# Altium schematic sheet Linear_Voltage_Regulator[Adjustable].SchDoc
size A; SheetNumber: 3; SheetTotal: 3
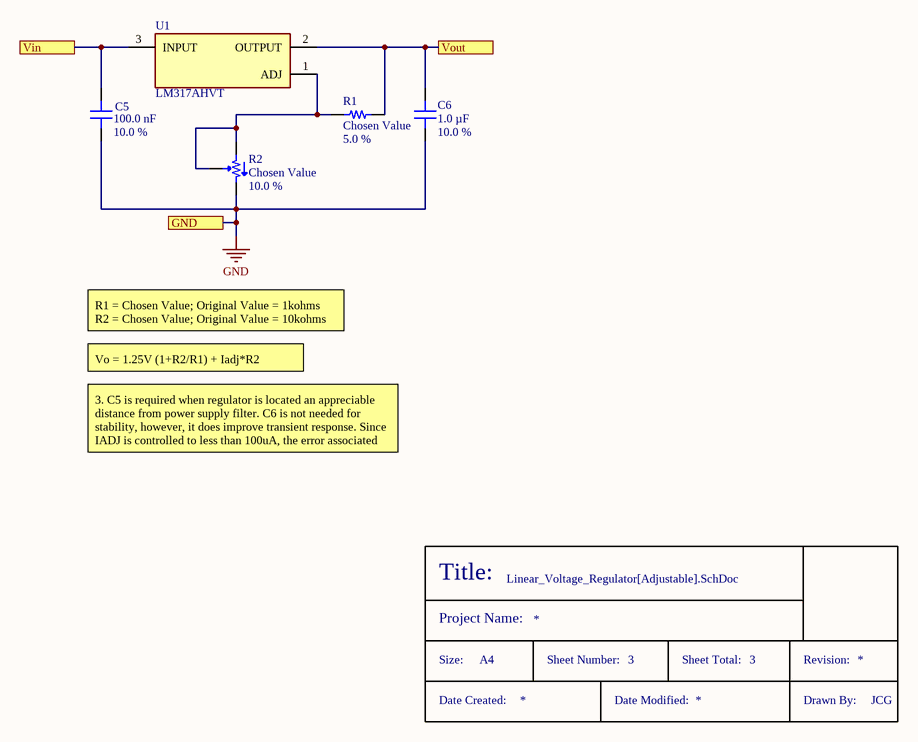
[diagram p0: Linear_Voltage_Regulator[Adjustable].SchDoc]

## Parts
*  Title_Block  (value not drawn)
C5  100.0 nF  Tolerance: 10.0 %  [PCB - CAPACITOR - MLCC - CAP 0_2 RADIAL DISC]
C6  1.0 µF  Tolerance: 10.0 %  [PCB - CAPACITOR - MLCC - CAP 0_2 RADIAL DISC]
R1  Chosen Value  Tolerance: 5.0 %  [PCB - RESISTOR - AXIAL]
R2  Chosen Value  Tolerance: 10.0 %  [PCB - RESISTOR - POTENTIOMETER TRIM POT BOURNS 3386]
U1  LM317AHVT  [FP-340AT-MFG]

## Ports
GND, Vin, Vout

## Nets
GND: C5.2 C6.2 R2.3 ; port GND
Vin: C5.1 U1.3(INPUT) ; port Vin
Vout: C6.1 R1.2 U1.2(OUTPUT) ; port Vout
NetR1_1: R1.1 R2.1 R2.2 U1.1(ADJ)

## Notes on the sheet
- Vo = 1.25V (1+R2/R1) + Iadj*R2
- R1 = Chosen Value; Original Value = 1kohms
  R2 = Chosen Value; Original Value = 10kohms
- 3. C5 is required when regulator is located an appreciable distance from power supply filter. C6 is not needed for stability, however, it does improve transient response. Since IADJ is controlled to less than 100uA, the error associated with this term is negligible in most applications.
- (in symbol Title_Block) Title:; Project Name:; Size:; A4; Sheet Number:; Sheet Total:; Revision:; Date Created:; Date Modified:; Drawn By:; JCG

## Library data of the parts
C5 = 1340: 0.1µF ±10% 50V Ceramic Capacitor X7R Radial; Rowan Part Number: 1340; Manufacturer: Vishay Beyschlag/Draloric/BC Components; Manufacturer part number: K104K15X7RF53H5; Name: 100.0 nF 50.0 V 10.0 % Ceramic Capacitor; Voltage Rating: 50.0 V; Supplier 1: Digi-Key; Supplier Part Number 1: BC3323-ND; Category: Capacitors; Datasheet: https://www.vishay.com/docs/45171/kseries.pdf; Status: Active; Capacitance: 100.0 nF; Composition: Ceramic; Packaging: Bulk; Package: Radial
C6 = 563: 1µF ±10% 50V Ceramic Capacitor X5R Radial; Rowan Part Number: 563; Manufacturer: TDK Corporation; Manufacturer part number: FG18X5R1H105KRT00; Name: 1.0 µF 50.0 V 10.0 % Ceramic Capacitor; Voltage Rating: 50.0 V; Supplier 1: Digi-Key; Supplier Part Number 1: 445-175540-ND; Category: Capacitors; Datasheet: https://product.tdk.com/info/en/catalog/datasheets/leadmlcc_halogenfree_fg_en.pdf?ref_disty=digikey; Status: Active; Capacitance: 1.0 µF; Composition: Ceramic; Packaging: Bulk; Package: Radial
R1 = 72: ___ kOhms ±5% 0.25W, 1/4W Through Hole Resistor Axial  Carbon Film; Rowan Part Number: 72; Manufacturer: Yageo; Manufacturer part number: CFR-25JB-52-1K; Name: 1.0 kΩ 250.0 mW 5.0 % Carbon Film Resistor; Power: 250.0 mW; Supplier 1: Digi-Key; Supplier Part Number 1: 1.0KQBK-ND; Category: Fixed; Datasheet: https://www.yageo.com/upload/media/product/products/datasheet/lr/Yageo_LR_CFR_1.pdf; Status: Active; Packaging: Bulk; Composition: Carbon Film; Resistance: Chosen Value; Package: Axial
R2 = 1349: ___ kOhms 0.5W, 1/2W PC Pins Through Hole Trimmer Potentiometer Cermet 1 Turn Side Adjustment; Rowan Part Number: 1349; Manufacturer: Bourns Inc.; Manufacturer part number: 3386W-1-103LF; Name: 10.0 kΩ 500.0 mW Through Hole Trimmer Potentiometer; Power: 500.0 mW; Number of Turns: 1.000000; Supplier 1: Digi-Key; Supplier Part Number 1: 3386W-103LF-ND; Category: Potentiometers; Datasheet: https://www.bourns.com/docs/Product-Datasheets/3386.pdf; Status: Active; Packaging: Tube; Composition: Cermet; Resistance: Chosen Value
U1 = CMP-07128-000014-1: IC REG LINEAR POS ADJ 1A TO220-3; Manufacturer: ON Semiconductor; Standoff Height: 2.7mm; Max Supply Voltage: 60V; Number Of Outputs: 1; Output Type: AdjustableProgrammable; Output Voltage: 1.2-57V; Output Current: 1.5A; Max Junction Temp: +125°C; Height: 20.4mm; Digikey Description: IC REG LINEAR POS ADJ 1A TO220-3; Temperature Range Low: -40°C; Lead Free: Yes; Manufacturer Part Number: LM317AHVT; ComponentLink2URL: https://www.onsemi.com/pub/Collateral/LM317AHV-D.pdf; Mouser Description: Linear Voltage Regulators Positive adj Reg 3Terminal; Package: 340AT; Device Class L1: Integrated Circuits (ICs); Device Class L2: Power Management ICs; Temperature: -40°C to +125°C; ComponentLink2Description: Datasheet; Footprint Url: https://www.onsemi.com/pub/Collateral/340AT.PDF; RoHS: TRUE; Automotive: No; Octopart: https://octopart.com/lm317ahvt-on+semiconductor-84329688; Device Class L3: Voltage Regulators - Linear; Temperature Range High: +125°C; Category: IC